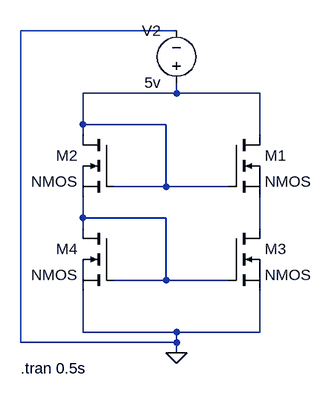
[diagram p0: schematic cascodecurrentmirror.asc]
cascodecurrentmirror.asc, the LTspice schematic file:
Version 4
SHEET 1 880 680
WIRE 128 -96 -112 -96
WIRE 128 0 128 -16
WIRE 128 0 -16 0
WIRE 256 0 128 0
WIRE -16 48 -16 0
WIRE 112 48 -16 48
WIRE -16 64 -16 48
WIRE 256 64 256 0
WIRE 112 144 112 48
WIRE 112 144 32 144
WIRE 208 144 112 144
WIRE -16 192 -16 160
WIRE 112 192 -16 192
WIRE -16 208 -16 192
WIRE 256 208 256 160
WIRE 112 288 112 192
WIRE 112 288 32 288
WIRE 208 288 112 288
WIRE -16 368 -16 304
WIRE 128 368 -16 368
WIRE 256 368 256 304
WIRE 256 368 128 368
WIRE -112 384 -112 -96
WIRE 128 384 128 368
WIRE 128 384 -112 384
WIRE 128 400 128 384
FLAG 128 400 0
SYMBOL nmos 208 64 R0
SYMATTR InstName M1
SYMBOL nmos 208 208 R0
SYMATTR InstName M3
SYMBOL nmos 32 64 M0
SYMATTR InstName M2
SYMBOL nmos 32 208 M0
SYMATTR InstName M4
SYMBOL voltage 128 0 R180
WINDOW 0 24 96 Left 2
WINDOW 3 24 16 Left 2
WINDOW 123 0 0 Left 0
WINDOW 39 0 0 Left 0
SYMATTR InstName V2
SYMATTR Value 5v
TEXT -112 424 Left 2 !.tran 0.5s

The netlist it stands for:
* cascodecurrentmirror.asc
M1 N001 N001 N003 N003 NMOS
M3 N003 N002 0 0 NMOS
M2 N001 N001 N002 N002 NMOS
M4 N002 N002 0 0 NMOS
V2 N001 0 5v
.model NMOS NMOS
.model PMOS PMOS
.lib standard.mos
.tran 0.5s
.backanno
.end